# Altium schematic sheet power_schematic.SchDoc: Power circuits
size A2; Organization: Altium Limited; Address1: L3, 12a Rodborough Rd; Address2: Frenchs Forest; Address3: NSW; Address4: Australia 2086; DocumentNumber: 6; SheetNumber: 6; SheetTotal: 8
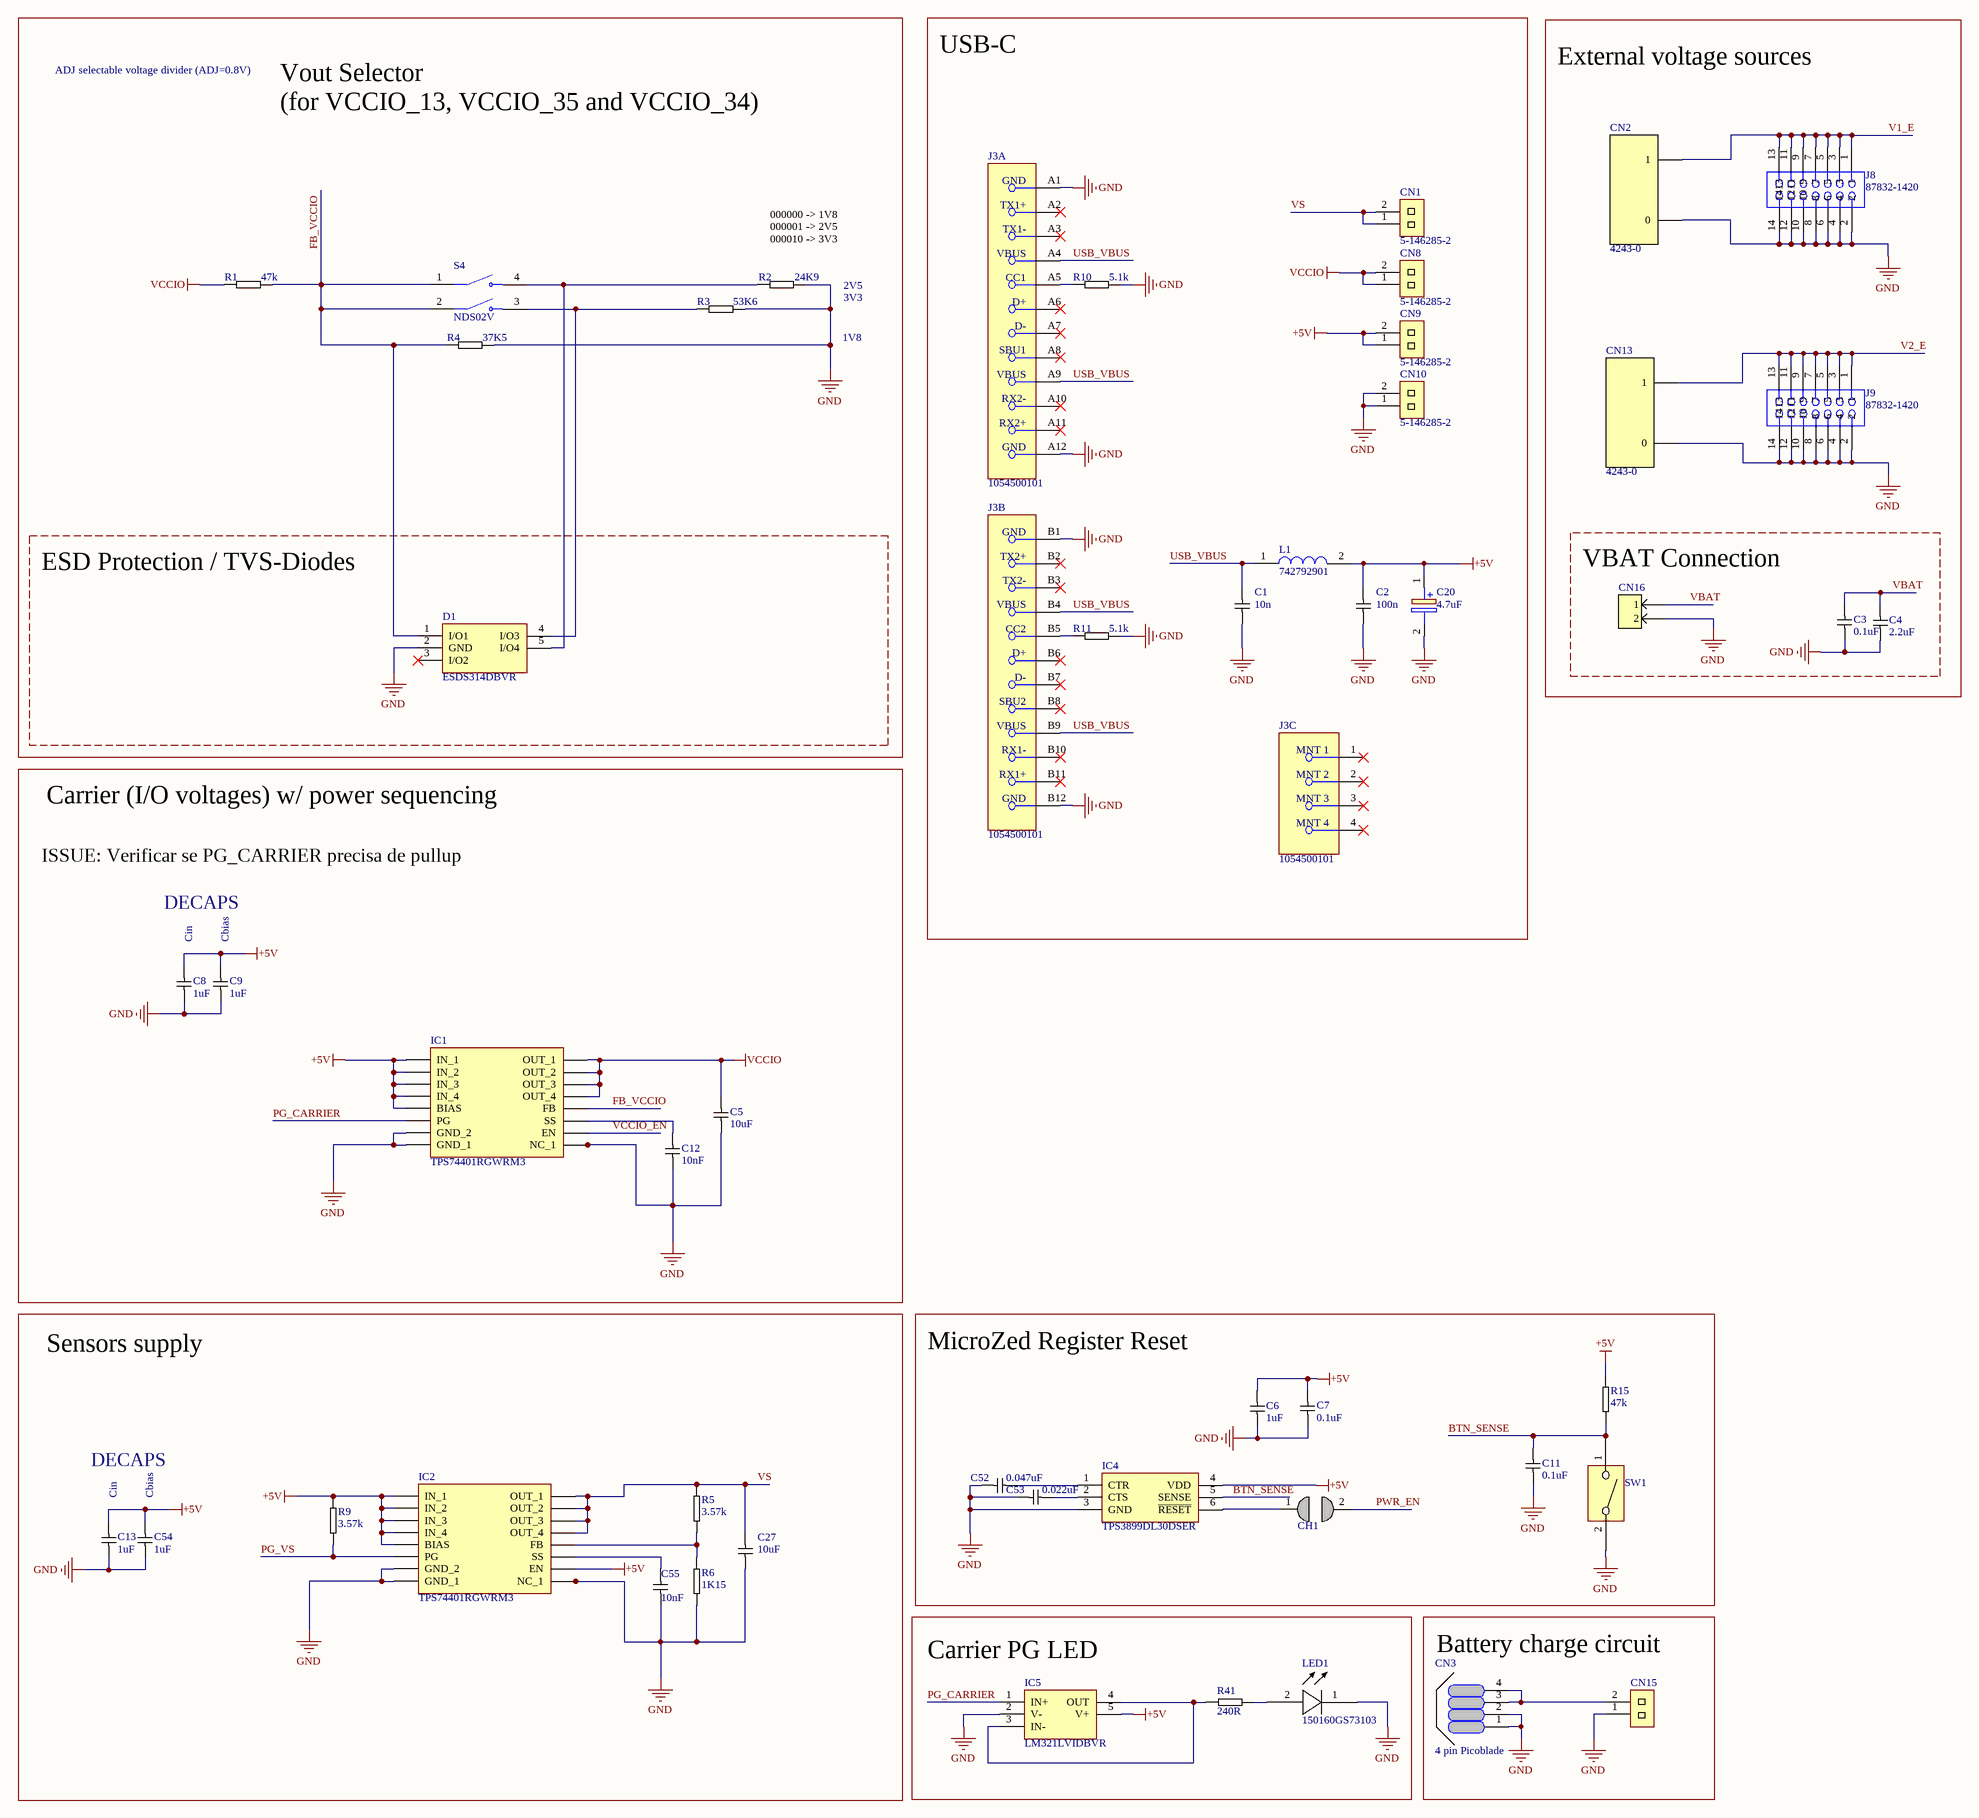
[diagram p0: power_schematic.SchDoc]

## Parts
C1  value 10n  [C0603_MD]  (hidden comment: GRM188R71C103KA01D)
C2  value 100n  [C0603_MD]  (hidden comment: CL10B104KA8NNNC)
C3  value 0.1uF  [C0603_MD]  (hidden comment: GRM188R71H104JA93D)
C4  value 2.2uF  [C0603_MD]  (hidden comment: EMK107BB7225MA-T)
C5  value 10uF  [C0603_MD]  (hidden comment: Cout)
C6  value 1uF  [C0603_MD]  (hidden comment: EMK107F105ZA-T)
C7  value 0.1uF  [C0603_MD]  (hidden comment: CL10B104KA8NNNC)
C8  Cin  value 1uF  [C0603_MD]
C9  Cbias  value 1uF  [C0603_MD]
C11  value 0.1uF  [C0603_MD]  (hidden comment: CL10B104KA8NNNC)
C12  value 10nF  [C0603_MD]  (hidden comment: CL10B103KB8NNNC)
C13  Cin  value 1uF  [C0603_MD]
C20  value 4.7uF  [CAPAE660X770N]  (hidden comment: 865080845004)
C27  value 10uF  [C0603_MD]  (hidden comment: Cout)
C52  value 0.047uF  [C0603_MD]  (hidden comment: CL10B473KB8NNNC)
C53  value 0.022uF  [C0603_MD]  (hidden comment: CL10B223KB8NNNC)
C54  Cbias  value 1uF  [C0603_MD]
C55  value 10nF  [C0603_MD]  (hidden comment: CL10B103KB8NNNC)
CH1  Solder Jumper  [Solder Jumper]  (value not drawn)
CN1  5-146285-2  [PIN BAR 2 2.54mm 180 GRAUS]
CN2  4243-0  [4243-0]
CN3  4 pin Picoblade  [PICO BLADE 0532610471]
CN8  5-146285-2  [PIN BAR 2 2.54mm 180 GRAUS]
CN9  5-146285-2  [PIN BAR 2 2.54mm 180 GRAUS]
CN10  5-146285-2  [PIN BAR 2 2.54mm 180 GRAUS]
CN13  4243-0  [4243-0]
CN15  JST 2 position header 2.5mm  [B2B-XH-A-M(LF)(SN)]  (value not drawn)
CN16  JST 2 position header 2.5mm  [B2B-XH-A-M(LF)(SN)]  (value not drawn)
D1  ESDS314DBVR  [SOT95P280X145-5N]
IC1  TPS74401RGWRM3  [QFN65P500X500X100-21N-D]
IC2  TPS74401RGWRM3  [QFN65P500X500X100-21N-D]
IC4  TPS3899DL30DSER  [TPS3899DL30DSER]
IC5  LM321LVIDBVR  [SOT95P280X145-5N]
J3  1054500101  [FP-1054500101-MFG]  (parts A,B,C of 3)
J8  87832-1420  [SAMTEC_TSW-107-05-F-D]
J9  87832-1420  [SAMTEC_TSW-107-05-F-D]
L1  742792901  [WE-PF_7427929...60]
LED1  150160GS73103  [0603 (1608 metric)]
R1  value 47k  [R0603_HD]  (hidden comment: RMCF0603FT47K0)
R2  value 24K9  [R0603_HD]  (hidden comment: ERJ-PB3B2492V)
R3  value 53K6  [R0603_HD]  (hidden comment: ERJH3ED3652V)
R4  value 37K5  [R0603_HD]  (hidden comment: ERJ-H3ED3652V)
R5  value 3.57k  [R0603_MD]  (hidden comment: RMCF0603FT3K57)
R6  value 1K15  [R0603_MD]  (hidden comment: CPF0603F1K15C1)
R9  value 3.57k  [R0603_MD]  (hidden comment: RMCF0603FT3K57)
R10  value 5.1k  [R0603_MD]  (hidden comment: RMCF0603FT5K10)
R11  value 5.1k  [R0603_MD]  (hidden comment: RMCF0603FT5K10)
R15  value 47k  [R0603_MD]  (hidden comment: RMCF0603FT47K0)
R41  value 240R  [R0603_MD]  (hidden comment: RC0603FR-07240RL)
S4  NDS02V  [NDS02V]
SW1  434123050836  [4341x30508x6]  (value not drawn)

## Blocks framed on the sheet
DECAPS: C5 C8 C9 C12 IC1
DECAPS: C13 C27 C54 C55 IC2 R5 R6 R9

## Nets
+5V: C2.1 C6.1 C7.1 C8.1 C9.1 C13.1 C20.1(+) C54.1 CN9.1 CN9.2 IC1.5(IN_1) IC1.6(IN_2) IC1.7(IN_3) IC1.8(IN_4) IC1.10(BIAS) IC2.5(IN_1) IC2.6(IN_2) IC2.7(IN_3) IC2.8(IN_4) IC2.10(BIAS) IC2.11(EN) IC4.4(VDD) IC5.5(V+) L1.2 R9.1 R15.1
GND: C1.2 C2.2 C3.2 C4.2 C5.2 C6.2 C7.2 C8.2 C9.2 C11.1 C12.2 C13.2 C20.2(-) C27.2 C52.2 C53.2 C54.2 C55.1 CN2.0 CN3.1 CN3.2 CN10.1 CN10.2 CN13.0 CN15.1 CN16.2 D1.2(GND) IC1.2(NC_1) IC1.3(NC_2) IC1.4(NC_3) IC1.12(GND_1) IC1.13(NC_4) IC1.14(NC_5) IC1.17(NC_6) IC1.21(GND_2) IC2.2(NC_1) IC2.3(NC_2) IC2.4(NC_3) IC2.12(GND_1) IC2.13(NC_4) IC2.14(NC_5) IC2.17(NC_6) IC2.21(GND_2) IC4.3(GND) IC5.2(V-) J3.A1(GND) J3.A12(GND) J3.B1(GND) J3.B12(GND) J8.2 J8.4 J8.6 J8.8 J8.10 J8.12 J8.14 J9.2 J9.4 J9.6 J9.8 J9.10 J9.12 J9.14 LED1.1(Cathode) R2.2 R3.2 R4.2 R6.2 R10.2 R11.2 SW1.2(C)
VCCIO: C5.1 CN8.1 CN8.2 IC1.1(OUT_1) IC1.18(OUT_2) IC1.19(OUT_3) IC1.20(OUT_4) R1.1
BTN_SENSE: C11.2 IC4.5(SENSE) R15.2 SW1.1(NC)
FB_VCCIO: D1.1(I/O1) IC1.16(FB) R1.2 R4.1 S4.1(COM_1) S4.2(COM_2)
PG_CARRIER: IC1.9(PG) IC5.1(IN+)
PG_VS: IC2.9(PG) R9.2
PWR_EN: CH1.2(C)
USB_VBUS: C1.1 J3.A4(VBUS) J3.A9(VBUS) J3.B4(VBUS) J3.B9(VBUS) L1.1
V1_E: CN2.1 J8.1 J8.3 J8.5 J8.7 J8.9 J8.11 J8.13
V2_E: CN13.1 J9.1 J9.3 J9.5 J9.7 J9.9 J9.11 J9.13
VBAT: C3.1 C4.1 CN16.1
VCCIO_EN: IC1.11(EN)
VS: C27.1 CN1.1 CN1.2 IC2.1(OUT_1) IC2.18(OUT_2) IC2.19(OUT_3) IC2.20(OUT_4) R5.1
NetC12_1: C12.1 IC1.15(SS)
NetC52_1: C52.1 IC4.1(CTR)
NetC53_1: C53.1 IC4.2(CTS)
NetC55_2: C55.2 IC2.15(SS)
NetCH1_1: CH1.1(NC) IC4.6(~{RESET})
NetCN3_3: CN3.3 CN3.4 CN15.2
NetD1_4: D1.4(I/O3) R3.1 S4.3(NO_1)
NetD1_5: D1.5(I/O4) R2.1 S4.4(NO_2)
NetIC2_16: IC2.16(FB) R5.2 R6.1
NetIC5_3: IC5.3(IN-) IC5.4(OUT) R41.1
NetJ3_A5: J3.A5(CC1) R10.1
NetJ3_B5: J3.B5(CC2) R11.1
NetLED1_2: LED1.2(anode) R41.2

Not connected (* = marked no-connect by the designer): D1 3(I/O2)*; J3 1(MNT_1)* 2(MNT_2)* 3(MNT_3)* 4(MNT_4)* A2(TX1+)* A3(TX1-)* A6(D+)* A7(D-)* A8(SBU1)* A10(RX2-)* A11(RX2+)* B2(TX2+)* B3(TX2-)* B6(D+)* B7(D-)* B8(SBU2)* B10(RX1-)* B11(RX1+)*

## Notes on the sheet
- USB-C
- ADJ selectable voltage divider (ADJ=0.8V)
- Vout Selector
  (for VCCIO_13, VCCIO_35 and VCCIO_34)
- External voltage sources
- (near R2) 000000 -> 1V8
  000001 -> 2V5
  000010 -> 3V3
- 2V5
- 3V3
- 1V8
- ESD Protection / TVS-Diodes
- (near CN16) VBAT Connection
- Carrier (I/O voltages) w/ power sequencing
- ISSUE: Verificar se PG_CARRIER precisa de pullup
- Sensors supply
- MicroZed Register Reset
- (near IC5) Carrier PG LED
- Battery charge circuit
- Project:
- SpaceLab - Federal University of Santa Catarina
- Title:
- Engineer:
- Project Code:
- Date:
- Revision:
- Sheet
- of
- Size:
- A3

## Library data of the parts
C1 = GRM188R71C103KA01D: CAP CER 10000PF 16V 10% X7R 0603; Manufacturer: Murata; Mount Type: SMD; Category: Ceramic; Dielectric: X7R; Supplier 1: Mouser; Supplier 2: Digi-Key; Supplier Part Number 1: 81-GRM18R71C103KA01D; Supplier Part Number 2: 490-1525-1-ND; Voltage: 16V
C2 C7 C11 = CL10B104KA8NNNC: CAP CER 0.1UF 25V X7R 0603; Manufacturer: Samsung Electro-Mechanics America, Inc.; Mount Type: SMD; Category: Ceramic; Dielectric: X7R; Supplier 1: Digikey; Supplier Part Number 1: 1276-1006-1-ND; Supplier 2: Arrow; Supplier Part Number 2: CL10B104KA8NNNC**MULT1; Voltage: 25V
C3 = GRM188R71H104JA93D: CAP CER 0.1UF 50V X7R 0603; Manufacturer: Murata Electronics North America; Mount Type: SMD; Category: Ceramic; Dielectric: X7R; Supplier 1: Digi-Key; Supplier Part Number 1: 490-13406-1-ND; Voltage: 50V
C4 = EMK107BB7225MA-T: CAP CER 2.2UF 16V X7R 0603; Manufacturer: Taiyo Yuden; Mount Type: SMD; Category: Ceramic; Dielectric: X7R; Supplier 1: Digi-Key; Supplier Part Number 1: 587-4864-1-ND; Supplier 2: Avnet; Supplier Part Number 2: EMK107BB7225MA-T; Supplier 3: Newark; Supplier Part Number 3: 16AC1148; Voltage: 16V
C5 C27 = GRM188C81C106MA73D: CAP CER 10UF 16V 20% X6S 0603; Manufacturer: Murata Electronics North America; Mount Type: SMD; Category: Ceramic; Dielectric: *; Supplier 1: Digi-Key; Supplier Part Number 1: 490-7198-1-ND; Voltage: 16V
C6 = EMK107F105ZA-T: CAP CER 1UF 16V Y5V 0603; Manufacturer: Taiyo Yuden; Mount Type: SMD; Category: Ceramic; Dielectric: Y5V; Supplier 1: Mouser; Supplier 2: Digi-Key; Supplier 3: Farnell; Supplier 4: Newark; Supplier Part Number 1: 963-EMK107F105ZA-T; Supplier Part Number 2: 587-1262-1-ND; Supplier Part Number 3: 1213833; Supplier Part Number 4: 18J2658; Voltage: 16V
C8 C9 C13 C54 = UMK107BJ105KA-T: CAP CER 1UF 50V 10% X5R 0603; Manufacturer: Taiyo Yuden; Mount Type: SMD; Category: *; Dielectric: *; Supplier 1: Digi-Key; Supplier Part Number 1: 587-2400-1-ND; Voltage: 50V
C12 C55 = CL10B103KB8NNNC: 10000pF 50V Ceramic Capacitor X7R 0603; Manufacturer: Samsung Electro-Mechanics America, Inc.; Mount Type: SMD; Category: Ceramic; Dielectric: X7R; Supplier 1: Digi-Key; Supplier Part Number 1: 1276-1009-1-ND; Supplier 2: Newark; Supplier Part Number 2: 30C5334; Supplier 3: Farnell; Supplier Part Number 3: 2253099; Voltage: 50V
C20 = 865080845004: Capacitor Polarised; Manufacturer_Name: Wurth Elektronik; Datasheet Link: https://www.we-online.com/components/products/datasheet/865080845004.pdf; Height: 7.7mm; Manufacturer_Part_Number: 865080845004; Mouser Part Number: 710-865080845004; Mouser Price/Stock: https://www.mouser.co.uk/ProductDetail/Wurth-Elektronik/865080845004?qs=amGC7iS6iy%2F670KNm88i8Q%3D%3D
C52 = CL10B473KB8NNNC: CAP CER 0.047UF 50V X7R 0603; Manufacturer: Samsung Electro-Mechanics; Mount Type: SMD; Category: Ceramic; Dielectric: X7R; Supplier 1: Digi-Key; Supplier Part Number 1: 1276-1063-1-ND; Voltage: 50V
C53 = CL10B223KB8NNNC: CAP CER 0.022UF 50V X7R 0603; Manufacturer: Samsung Electro-Mechanics America, Inc.; Mount Type: SMD; Category: Ceramic; Dielectric: X7R; Supplier 1: Arrow; Supplier Part Number 1: CL10B223KB8NNNC**MULT1; Supplier 2: Digi-Key; Supplier Part Number 2: 1276-1104-1-ND; Voltage: 50V
CH1 = Solder Jumper: PCB Solder jumper; Action: Latched; Circuit: SPST; Manufacturer: *; Mount Type: SMD
CN1 CN8-CN10 = 5-146285-2: 02 MODII HDR SRST B/A .100CL; Manufacturer: TE Connectivity; N of Positions: 2; Pitch: 2.54mm; Mount Type: PTH; Supplier 1: Arrow; Supplier 2: Mouser; Supplier 3: Newark; Supplier 4: Digi-Key; Supplier 5: Farnell; Supplier Part Number 1: 38922002; Supplier Part Number 2: 571-5-146285-2; Supplier Part Number 3: 16M3972; Supplier Part Number 4: 5-146285-2-ND; Supplier Part Number 5: 1341684; Value: 5-146285-2
CN2 CN13 = 4243-0: POMONA, 4243-0, Binding Post, 4243 Series, 15 A, 60 VDC, Tin Plated Contacts, Brass, Black; Manufacturer: Pomona Electronics; Voltage Rating: 2.5kV; Current Rating: 15A; Voltage Rating (DC): 60V; Voltage Rating (AC): 30V; Insulation: Insulated; Number of Ports: 2; Hole Diameter: 0.1inch; Panel Thickness: 6.35mm; Supplier 1: Digi-Key; Manufacturer Part Number: 4243-0; RoHS: Yes; Category: Connectors; Stock 1: 327; Pricing 1: 1=8.99000, 25=8.54040, 50=8.09100, 100=7.73150 (USD); Mount: Panel; Number of Pins: 1; Contact Plating: Tin,Bright; Contact Material: Brass; Color: Black,Red; Housing Material: Polycarbonate; Housing Color: Black; Body Material: Brass; Insulation Material: Polycarbonate; Package Quantity: 5; Packaging: Bulk; Termination: Turret; Orientation: Straight; Max Current Rating: 15A; Length: 30.23mm; Depth: 11.18mm; REACH SVHC: No SVHC; Lead Free: Lead Free; ComponentLink1URL: https://datasheet.ciiva.com/1453/d4243-1-01-1453890.pdf?src-supplier=Element14; ComponentLink1Description: https://datasheet.ciiva.com/1453/d4243-1-01-1453890.pdf?src-supplier=Element14; ComponentLink2URL: https://datasheet.ciiva.com/16883/70198115-16883751.pdf?src-supplier=Allied+Electronics; ComponentLink2Description: https://datasheet.ciiva.com/16883/70198115-16883751.pdf?src-supplier=Allied+Electronics; ComponentLink3URL: https://datasheet.ciiva.com/30105/d4243-1-02-30105753.pdf?src-supplier=Onlinecomponents.com; ComponentLink3Description: https://datasheet.ciiva.com/30105/d4243-1-02-30105753.pdf?src-supplier=Onlinecomponents.com; Supplier Part Number 1: 501-1126-ND
CN3 = 0533980471: 1.25mm Pitch PicoBlade™ Header, Surface Mount, Vertical, 4 Circuits; Manufacturer: Molex; Manufacturer Part Number: 53398-0471; N of Positions: 4; Body Plating: Tin; Gender: Male; Current Rating: 1A; Voltage Rating: 125V; Contact Resistance: 20mR; Insulation Resistance: 100MR; Glow Wire Compliant: Non-compliant; Pitch: 1.25mm; Mount Type: SMD; Value: 0533980471; Supplier 1: Digi-Key; Supplier Part Number 1: WM7608CT-ND; Stock 1: 21236; Pricing 1: 1=1.19, 10=1.044, 100=0.901, 500=0.73716 (USD); Mount: Surface Mount; Contact Plating: Tin; Contact Material: Bronze,Tin,Brass; Color: Natural; Housing Color: Natural; Housing Material: Nylon; Min Operating Temperature: -40°C; Max Operating Temperature: 85°C; Number of Rows: 1; Packaging: Tape and Reel; Number of Positions: 4; Termination: Solder; Package Quantity: 1000; Voltage Rating (AC): 125V; Number of Contacts: 4; Working Voltage: 125V; Orientation: Vertical; Number of Circuits: 4; Voltage Rating (DC): 125V; Lead Pitch: 1.25mm; Radiation Hardening: No; Flammability Rating: UL94 V-0; REACH SVHC: Unknown; Lead Free: Lead Free; ComponentLink1URL: http://www.mouser.com/ds/2/276/0533980471_PCB_HEADERS-171069.pdf?src-supplier=Mouser; ComponentLink1Description: http://www.mouser.com/ds/2/276/0533980471_PCB_HEADERS-171069.pdf?src-supplier=Mouser; ComponentLink2URL: http://www.jameco.com/Jameco/Products/ProdDS/1932627.pdf?src-supplier=Jameco; ComponentLink2Description: http://www.jameco.com/Jameco/Products/ProdDS/1932627.pdf?src-supplier=Jameco; ComponentLink3URL: https://www.distrelec.biz/Web/Downloads/46/_e/gf116833-116846_e.pdf?mime=application%2Fpdf&src-supplier=Distrelec; ComponentLink3Description: https://www.distrelec.biz/Web/Downloads/46/_e/gf116833-116846_e.pdf?mime=application%2Fpdf&src-supplier=Distrelec; ComponentLink4URL: http://www.molex.com/webdocs/datasheets/pdf/en-us/0533980471_PCB_HEADERS.pdf?src-supplier=Element14; ComponentLink4Description: http://www.molex.com/webdocs/datasheets/pdf/en-us/0533980471_PCB_HEADERS.pdf?src-supplier=Element14; ComponentLink5URL: http://www.farnell.com/datasheets/1867381.pdf?src-supplier=Element14; ComponentLink5Description: http://www.farnell.com/datasheets/1867381.pdf?src-supplier=Element14; ComponentLink6URL: http://uk.rs-online.com/webdocs/13c4/0900766b813c4500.pdf?src-supplier=RSComponents; ComponentLink6Description: http://uk.rs-online.com/webdocs/13c4/0900766b813c4500.pdf?src-supplier=RSComponents; ComponentLink7URL: http://www.molex.com/webdocs/datasheets/pdf/en-us/0533980471_PCB_HEADERS.pdf?src-supplier=Farnell; ComponentLink7Description: http://www.molex.com/webdocs/datasheets/pdf/en-us/0533980471_PCB_HEADERS.pdf?src-supplier=Farnell; ComponentLink8URL: http://www.farnell.com/datasheets/2697809.pdf?src-supplier=Element14; ComponentLink8Description: http://www.farnell.com/datasheets/2697809.pdf?src-supplier=Element14; ComponentLink9URL: http://www.molex.com/webdocs/datasheets/pdf/en-us/0533980471_PCB_HEADERS.pdf?src-supplier=Avnet; ComponentLink9Description: http://www.molex.com/webdocs/datasheets/pdf/en-us/0533980471_PCB_HEADERS.pdf?src-supplier=Avnet; ComponentLink10URL: http://www.molex.com/webdocs/datasheets/pdf/en-us/0533980471_PCB_HEADERS.pdf?src-supplier=Avnet+Europe; ComponentLink10Description: http://www.molex.com/webdocs/datasheets/pdf/en-us/0533980471_PCB_HEADERS.pdf?src-supplier=Avnet+Europe; Supplier 2: Mouser; Supplier Part Number 2: 538-53398-0471; Stock 2: 43680; Pricing 2: 1=0.98, 10=0.832, 100=0.716, 500=0.6, 1000=0.391, 2000=0.342 (USD)
CN15 = 5-146285-2: CONN HEADER TOP 2POS 2.5MM GRN; Manufacturer: TE Connectivity; N of Positions: 2; Pitch: 2.54mm; Mount Type: PTH; Supplier 1: Arrow; Supplier 2: Mouser; Supplier 3: Newark; Supplier 4: Digi-Key; Supplier 5: Farnell; Supplier Part Number 1: 38922002; Supplier Part Number 2: 571-5-146285-2; Supplier Part Number 3: 16M3972; Supplier Part Number 4: 5-146285-2-ND; Supplier Part Number 5: 1341684; Value: 5-146285-2
CN16 = B2B-XH-A-M(LF)(SN): CONN HEADER TOP 2POS 2.5MM GRN; Number of Positions: 2; Connector Type: Male Pin; Pitch: 0.098inch; Supplier 1: Digi-Key; Supplier Part Number 1: 455-2879-ND; Manufacturer: JST; Stock 1: 5564; Pricing 1: 1=0.17, 10=0.157, 100=0.0966, 500=0.07998, 1000=0.06999, 5000=0.05999, 10000=0.05832 (USD); Mount: Through Hole; Color: Natural; Contact Plating: Tin; Packaging: Bulk; Number of Rows: 1; Termination: Press-Fit; Fastening Type: Detent; Package Quantity: 1000; Manufacturer Part Number: B2B-XH-A-M(LF)(SN); ComponentLink1Description: http://www.jst-mfg.com/product/pdf/eng/eXH.pdf; ComponentLink1URL: http://www.jst-mfg.com/product/pdf/eng/eXH.pdf
D1 = ESDS314DBVR: Diode; Manufacturer_Name: Texas Instruments; Datasheet Link: http://www.ti.com/lit/gpn/esds314; Height: 1.45mm; Manufacturer_Part_Number: ESDS314DBVR; Mouser Part Number: 595-ESDS314DBVR; Mouser Price/Stock: https://www.mouser.co.uk/ProductDetail/Texas-Instruments/ESDS314DBVR?qs=w%2Fv1CP2dgqpkGBpJKrSLAg%3D%3D; Arrow Part Number: ESDS314DBVR; Arrow Price/Stock: https://www.arrow.com/en/products/esds314dbvr/texas-instruments?utm_currency=USD&region=nac
IC1 IC2 = TPS74401RGWRM3: Integrated Circuit; Manufacturer_Name: Texas Instruments; Datasheet Link: https://www.ti.com/lit/ds/symlink/tps74401.pdf?ts=1748825387292; Height: 1mm; Manufacturer_Part_Number: TPS74401RGWRM3; Mouser Part Number: 595-TPS74401RGWRM3; Mouser Price/Stock: https://www.mouser.co.uk/ProductDetail/Texas-Instruments/TPS74401RGWRM3?qs=jcD%2FCkGBYeMb5sDaJ6BKNg%3D%3D
IC4 = TPS3899DL30DSER: Integrated Circuit; Manufacturer_Name: Texas Instruments; Datasheet Link: https://www.ti.com/lit/ds/symlink/tps3899.pdf?ts=1744754683287&ref_url=https%253A%252F%252Fwww.mouser.com%252F; Height: 0.8mm; Manufacturer_Part_Number: TPS3899DL30DSER; Mouser Part Number: 595-TPS3899DL30DSER; Mouser Price/Stock: https://www.mouser.co.uk/ProductDetail/Texas-Instruments/TPS3899DL30DSER?qs=pBJMDPsKWf3Gvj4NR5zaDA%3D%3D
IC5 = LM321LVIDBVR: Integrated Circuit; Manufacturer_Name: Texas Instruments; Datasheet Link: http://www.ti.com/lit/gpn/lm321lv; Height: 1.45mm; Manufacturer_Part_Number: LM321LVIDBVR; Mouser Part Number: 595-LM321LVIDBVR; Mouser Price/Stock: https://www.mouser.co.uk/ProductDetail/Texas-Instruments/LM321LVIDBVR?qs=qSfuJ%252Bfl%2Fd66sZ569ResAQ%3D%3D; Arrow Part Number: LM321LVIDBVR; Arrow Price/Stock: https://www.arrow.com/en/products/lm321lvidbvr/texas-instruments?utm_currency=USD&region=europe
J3 = CMP-04767-000004-1: CONN RCP USB3.1 TYPEC 24P SMD RA; Manufacturer: Molex; Number Of Contacts: 24; Voltage Rating: 30V; Shielding: true; Is Female: yes; Current Rating: 0.25/1.25/5A; Pitch: 0.5mm; Conn Orientation: Right Angle; Package: 0; Height: 3.44mm; Footprint Url: https://www.molex.com/pdm_docs/sd/1054500101_sd.pdf; Device Class L1: Connectors; Category: Conn; Device Class L2: USB Connectors; Digikey Description: CONN RCP USB3.1 TYPEC 24P SMD RA; Contact Material: Gold,Nickel; Mouser Description: USB Shielded I/O Receptacle; Type C; Right Angle; Surface Mount; Gold over Nickel; ComponentLink2Description: Datasheet; Lead Free: Yes; Automotive: No; Temperature Range High: +85°C; RoHS: TRUE; Octopart: https://octopart.com/105450-0101-molex-68082325; ComponentLink2URL: https://www.molex.com/webdocs/datasheets/pdf/en-us/1054500101_IO_CONNECTORS.pdf; Temperature: -30°C to +85°C; Usb Standard: USB 3.1; Temperature Range Low: -30°C; Device Class L3: unset; Manufacturer Part Number: 1054500101
J8 J9 = 87832-1420: Connector Header Surface Mount 14 position 0.079 _2.00mm_; Manufacturer Part Number: TSW-107-05-F-D; MF: Molex; Value: *; SnapEDA_Link: https://www.snapeda.com/parts/87832-1420/Molex/view-part/78740/?ref=snap; Price: None; Package: None; Availability: Unavailable
L1 = 742792901: Inductor; Manufacturer_Name: Wurth Elektronik; Manufacturer_Part_Number: 742792901; Mouser Part Number: 710-742792901; Mouser Price/Stock: https://www.mouser.co.uk/ProductDetail/Wurth-Elektronik/742792901?qs=8K4tMJJn4OFrhST66k9YRg%3D%3D
R1 R15 = RMCF0603FT47K0: RES 47K OHM 1/10W 1% 0603; Manufacturer: Stackpole Electronics Inc; Mount Type: SMD; Tolerance: 1%; Supplier 1: Digi-Key; Supplier Part Number 1: RMCF0603FT47K0CT-ND; Power: 1/10W
R2 = ERJ-PB3B2492V: Resistor; Manufacturer_Name: Panasonic; Datasheet Link: https://www.mouser.com/ProductDetail/Panasonic/ERJ-PB3B2492V?qs=RYIBGgAklzKijK5IgOR%2FVg%3D%3D; Height: 0.55mm; Manufacturer_Part_Number: ERJ-PB3B2492V; Mouser Part Number: 667-ERJ-PB3B2492V; Mouser Price/Stock: https://www.mouser.co.uk/ProductDetail/Panasonic/ERJ-PB3B2492V?qs=RYIBGgAklzKijK5IgOR%2FVg%3D%3D
R3 = ERJH3ED3652V: Resistor; Manufacturer_Name: Panasonic; Datasheet Link: http://industrial.panasonic.com/cdbs/www-data/pdf/RDQ0000/ast-ind-151033.pdf; Manufacturer_Part_Number: ERJH3ED3652V
R4 = ERJ-H3ED3652V: Resistor; Manufacturer_Name: Panasonic; Datasheet Link: http://industrial.panasonic.com/cdbs/www-data/pdf/RDQ0000/ast-ind-151033.pdf; Manufacturer_Part_Number: ERJ-H3ED3652V
R5 R9 = RMCF0603FT3K57: RES 3.57K OHM 1/10W 1% 0603; Manufacturer: Stackpole Electronics Inc; Mount Type: SMD; Tolerance: 1%; Supplier 1: Digi-Key; Supplier 2: Newark; Supplier Part Number 1: RMCF0603FT3K57CT-ND; Supplier Part Number 2: 89M6753; Power: 1/10W
R6 = CPF0603F1K15C1: Resistor; Manufacturer_Name: TE Connectivity; Datasheet Link: https://www.te.com/commerce/DocumentDelivery/DDEController?Action=srchrtrv&DocNm=8-1773459-4_ELEVATOR_ESCALATOR_SOLUTIONS&DocType=Data%20Sheet&DocLang=English&PartCntxt=6-1879336-8&DocFormat=pdf; Height: 0.55mm; Manufacturer_Part_Number: CPF0603F1K15C1; Mouser Part Number: 279-CPF0603F1K15C1; Mouser Price/Stock: https://www.mouser.co.uk/ProductDetail/TE-Connectivity-Holsworthy/CPF0603F1K15C1?qs=8G8kQhBkhGik2Xy5fY9yCw%3D%3D
R10 R11 = RMCF0603FT5K10: RES 5.1K OHM 1/10W 1% 0603; Manufacturer: Stackpole Electronics Inc; Mount Type: SMD; Tolerance: 1%; Supplier 1: Digi-Key; Supplier Part Number 1: RMCF0603FT5K10CT-ND; Power: 1/10W
R41 = RC0603FR-07240RL: RES SMD 240 OHM 1% 1/10W 0603; Manufacturer: Yageo; Mount Type: SMD; Tolerance: 1%; Supplier 1: Farnell; Supplier Part Number 1: 9330860; Supplier 2: Digi-Key; Supplier Part Number 2: 311-240HRCT-ND; Supplier 3: Newark; Supplier Part Number 3: 65T8389; Power: 1/10W
S4 = NDS02V: Switch; Manufacturer_Name: Apem; Datasheet Link: https://componentsearchengine.com/Datasheets/2/NDS02V.pdf; Height: 7.05mm; Manufacturer_Part_Number: NDS02V; Mouser Part Number: 642-NDS02V; Mouser Price/Stock: https://www.mouser.co.uk/ProductDetail/Apem/NDS02V?qs=Rt2YTNbomKgQBAMS%252Bs5rFQ%3D%3D
SW1 = 434123050836: SWITCH TACTILE SPST-NO 0.05A 12V; Manufacturer: Wurth Electronics Inc.; Action: Momentary; Circuit: SPST; Mount Type: SMD; Supplier 1: Farnell; Supplier Part Number 1: 2459527; Supplier 2: Digi-Key; Supplier Part Number 2: 732-7054-1-ND; Supplier 3: Farnell; Supplier Part Number 3: 9471898; Supplier 4: Digi-Key; Supplier Part Number 4: 732-7054-6-ND; Supplier 5: Farnell; Supplier Part Number 5: 2079577; Supplier 6: Farnell; Supplier Part Number 6: 2079521